# EAGLE design Breakoutboard (EAGLE 6.5.0)
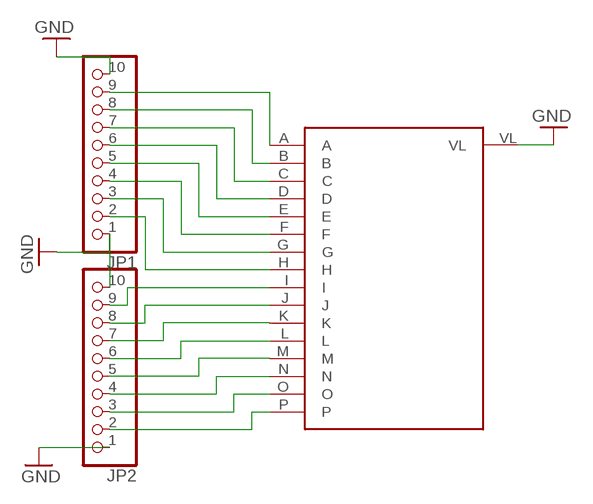
[diagram p0: schematic, sheet 1]

## Parts
JP1  PINHD-1X10  [1X10]
JP2  PINHD-1X10  [1X10]
U$1  1.27KW-104AL  [127]

## Nets
GND: JP1.1 JP1.10 JP2.1 JP2.10 U$1.VL
N$1: JP1.9 U$1.A
N$2: JP1.8 U$1.B
N$3: JP1.7 U$1.C
N$4: JP1.6 U$1.D
N$5: JP1.5 U$1.E
N$6: JP1.4 U$1.F
N$7: JP1.3 U$1.G
N$8: JP1.2 U$1.H
N$9: JP2.9 U$1.I
N$10: JP2.8 U$1.J
N$11: JP2.7 U$1.K
N$12: JP2.6 U$1.L
N$13: JP2.5 U$1.M
N$14: JP2.4 U$1.N
N$15: JP2.3 U$1.O
N$16: JP2.2 U$1.P

## Library data of the parts
JP1 JP2 = pinhead:PINHD-1X10: PIN HEADER
U$1 = KW-104AL:1.27

## Board
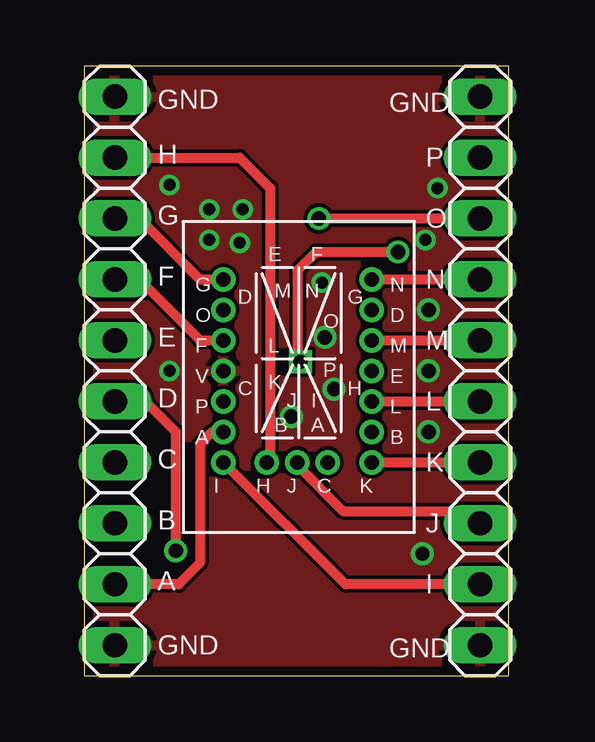
[diagram p1: board, top side]
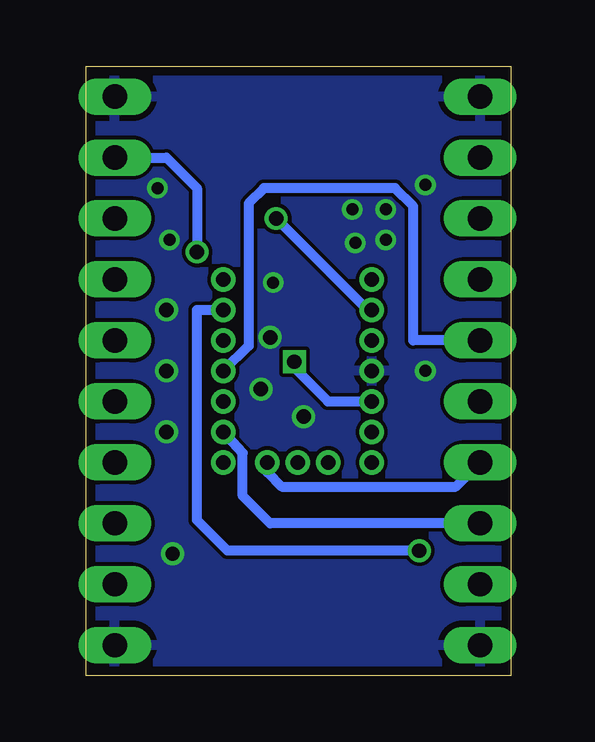
[diagram p2: board, bottom side, seen from below]

Size 17.7 x 25.39 mm. Coordinates in mm from the lower left corner, seen from the top.
Outline: 0,0 17.7,0 17.7,25.39 0,25.39 0,0
Copper layers (1*16): Top 0.0356mm / dielectric 1.5011mm / Bottom 0.0356mm
Design rules "LaenPCBOrder *": minimum track width 6mil, minimum drill 13mil, track to track 6mil, track to pad 6mil, pad to pad 6mil, via to via 6mil, smd to smd 6mil, copper to edge 15mil, drill to drill 6mil, minimum pad ring 7mil, minimum via ring 7mil, stop-mask expansion 3mil, vias tented up to drill 200mil, thermal gap 10mil

### Footprints (pad centres in the part's own frame; a part is rotated, then mirrored left to right if it is on the bottom)
1X10 = drill 1.016 long: 1 -11.43,0; 2 -8.89,0; 3 -6.35,0; 4 -3.81,0; 5 -1.27,0; 6 1.27,0; 7 3.81,0; 8 6.35,0; 9 8.89,0; 10 11.43,0
127 = drill 0.6 pad 1.016: A -3.15,-1.778; B 3.048,-1.778; C 1.204,-3.048; D 3.048,3.302; E 3.048,0.762; F -3.15,2.032; G -3.15,4.572; H -1.336,-3.048; I -3.15,-3.048; J -0.066,-3.048; K 3.048,-3.048; L 3.048,-0.508; M 3.048,2.032; N 3.048,4.572; O -3.15,3.302; P -3.15,-0.508; VL -3.15,0.762

### Placement (x,y rotation side)
JP1  1.27,12.7 270 top
JP2  16.51,12.7 270 top
U$1  8.94,11.94 0 top

### Tracks (layer width: path | path; a pad name or v marks a point on that pad's centre or on a via)
GND  (via drill 0.5, 0.6)
  other vias: 10.03,14.1 5.21,19.43 14.73,20.32 3.56,12.7 9.91,16.38 10.41,11.94 8.64,10.79 6.48,18.03 3.56,20.45 14.22,18.16 6.6,19.43 5.21,18.16 14.1,5.08 14.35,10.16 14.35,12.7 14.35,15.24
  pour Bottom: -5.08,27.94 22.86,27.94 22.86,-5.08 -5.08,-5.08
  pour Top: -2.54,30.48 20.32,30.48 20.32,-2.54 -2.54,-2.54
N$1
  Top 0.406: U$1.A 5.33,10.16 4.83,9.65 4.83,4.7 3.94,3.81 JP1.9
N$2
  Bottom 0.406: JP1.8 10.03,6.35 11.18,7.49 11.18,9.27 U$1.B
N$3
  Bottom 0.406: U$1.C 10.14,8.47 9.55,7.87 2.29,7.87 JP1.7
N$4  (via drill 0.6)
  Top 0.406: JP1.6 2.54,11.43 3.81,10.16 v3.81,5.21
  Bottom 0.406: v3.81,5.21 11.81,5.21 13.08,6.48 13.08,15.24 U$1.D
N$5
  Bottom 0.406: JP1.5 4.06,13.97 4.06,19.56 4.83,20.32 10.29,20.32 10.92,19.68 10.92,13.74 U$1.E
N$6
  Top 0.406: JP1.4 2.29,16.51 4.83,13.97 U$1.F
N$7
  Top 0.406: JP1.3 2.29,19.05 4.8,16.51 U$1.G
N$8
  Top 0.406: JP1.2 6.48,21.59 7.75,20.32 7.75,8.96 U$1.H
N$9
  Top 0.406: JP2.9 10.9,3.81 U$1.I
N$10
  Top 0.406: U$1.J 8.89,8.76 10.79,6.86 16.51,6.86 JP2.8
N$11
  Top 0.406: U$1.K JP2.7
N$12
  Top 0.406: U$1.L JP2.6
N$13
  Top 0.406: U$1.M JP2.5
N$14
  Top 0.406: U$1.N JP2.4
N$15  (via drill 0.6)
  Top 0.406: v9.78,19.05 JP2.3
  Bottom 0.406: U$1.O 5.97,15.24 v9.78,19.05
N$16  (via drill 0.6)
  Top 0.406: v13.08,17.65 9.65,17.65 8.89,16.89 8.89,13.21 v9.02,13.08
  Bottom 0.406: JP2.2 14.35,21.59 13.08,20.32 v13.08,17.65 | v9.02,13.08 9.02,12.83 7.62,11.43 U$1.P

### Text on the board
tNames: GND | GND | H | P | G | O | F | N | E | M | D | L | C | K | B | J | A | I | GND | GND